# EasyEDA schematic New Project.json
TITLE: Sheet_1; REV: 1.0; Date: 2024-03-31; Sheet: 1/1; Company: Your Company
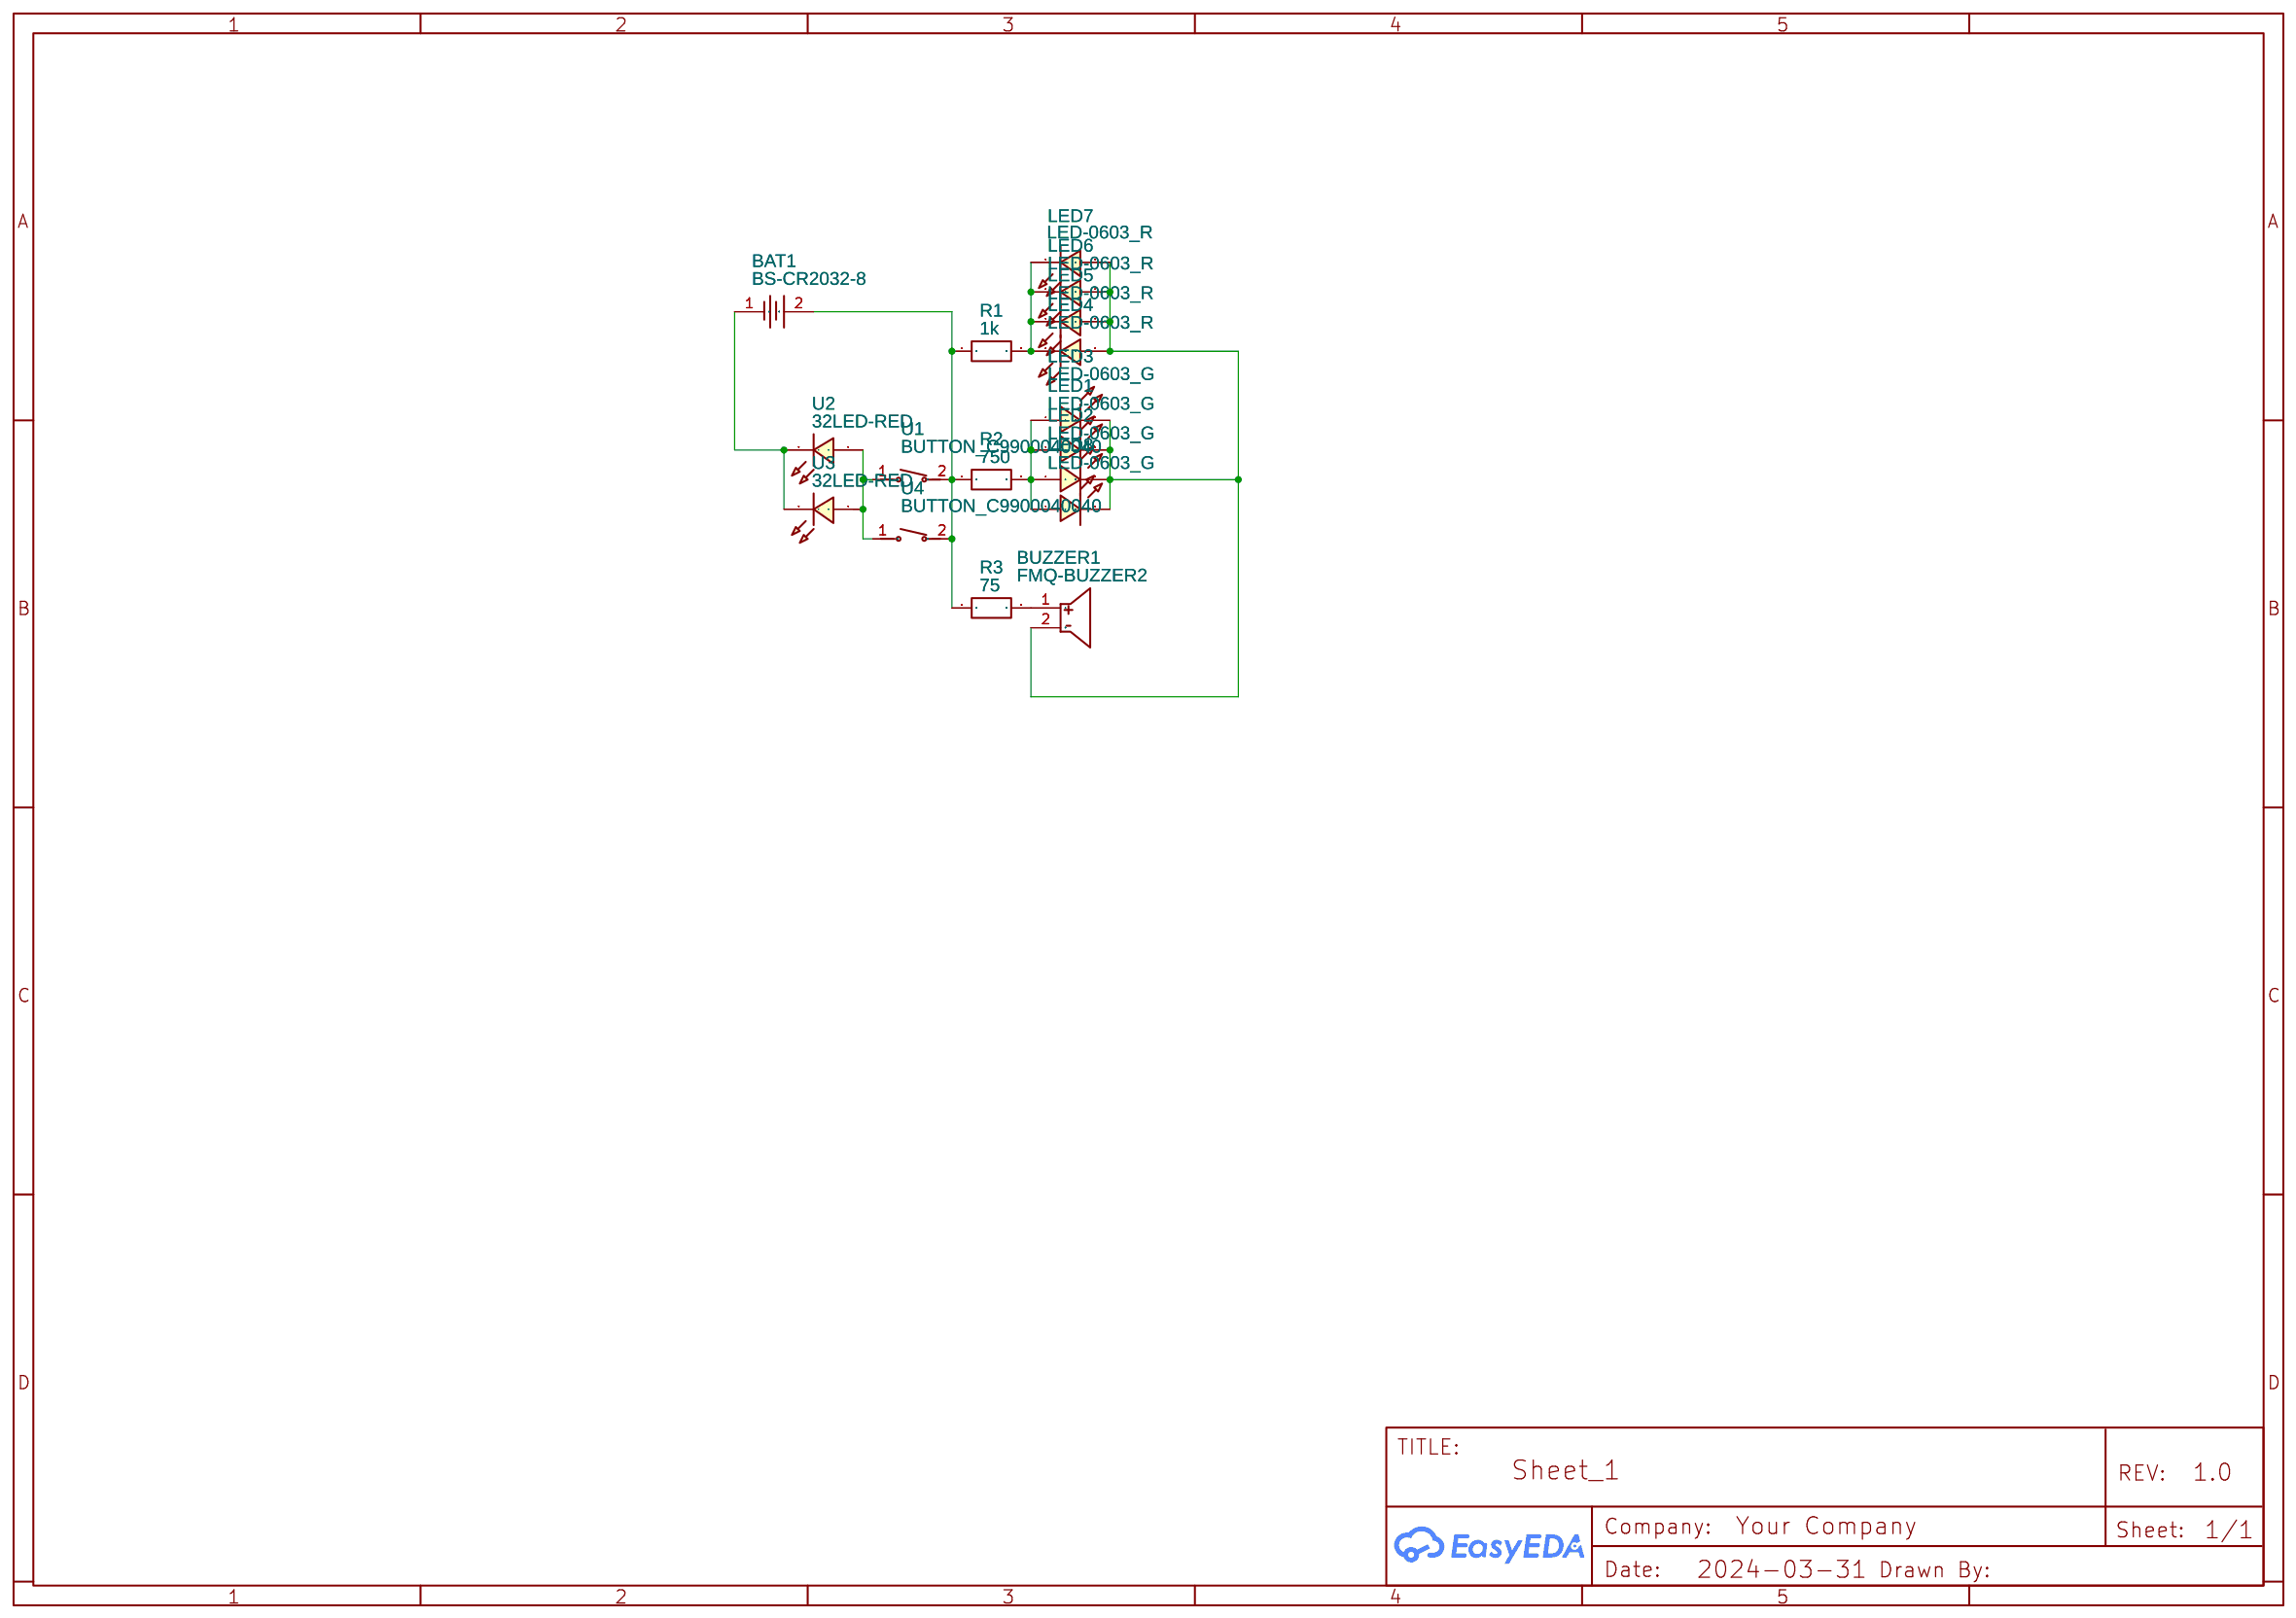
[diagram p0: schematic sheet]

## Parts
BAT1  BS-CR2032-8  [BAT-SMD_BS-CR2032-8]
BUZZER1  FMQ-BUZZER2  [BUZ-TH_BD12.0-P7.60-D0.6-FD]
LED1  LED-0603_G  [LED0603_GREEN]
LED2  LED-0603_G  [LED0603_GREEN]
LED3  LED-0603_G  [LED0603_GREEN]
LED4  LED-0603_R  [LED0603_RED]
LED5  LED-0603_R  [LED0603_RED]
LED6  LED-0603_R  [LED0603_RED]
LED7  LED-0603_R  [LED0603_RED]
LED8  LED-0603_G  [LED0603_GREEN]
R1  1k  [R1206]
R2  750  [R1206]
R3  75  [R1206]
U1  BUTTON_C9900040040  [KEY-SMD_L6.0-W6.0-LS6.6]
U2  32LED-RED  [LED-TH_L5..8-W5.6-P2.54_32LED-RED]
U3  32LED-RED  [LED-TH_L5..8-W5.6-P2.54_32LED-RED]
U4  BUTTON_C9900040040  [KEY-SMD_L6.0-W6.0-LS6.6]

## Library data of the parts
BAT1 = BS-CR2032-8: Supplier: LCSC; Supplier Part: C7498149; Manufacturer: LX(连欣科技); Contributor: lcsc; JLCPCB Part Class: Extended Part
BUZZER1 = FMQ-BUZZER2: Contributor: LCSC; Supplier: LCSC; Supplier Part: C9900006103; JLCPCB Part Class: Extended Part; Manufacturer: null
LED1-LED3 LED8 = LED-0603_G: Manufacturer: EVERLIGHT(台湾亿光); Manufacturer Part: 19-217/GHC-YR1S2/3T; Supplier Part: C72043; Supplier: LCSC; Contributor: LCEDA_Lib
LED4-LED7 = LED-0603_R: Manufacturer: EVERLIGHT(台湾亿光); Manufacturer Part: 19-217/R6C-AL1M2VY/3T; Supplier Part: C72044; Supplier: LCSC; Contributor: LCEDA_01
R1-R3 = R_1206_EU: Contributor: LCEDA_Lib
U1 U4 = BUTTON_C9900040040: Contributor: lcsc; Supplier: LCSC; Supplier Part: C9900040040; Manufacturer: null; Manufacturer Part: BUTTON; JLCPCB Part Class: Extended Part
U2 U3 = 32LED-RED: Supplier: LCSC; Supplier Part: C3306983; Manufacturer: Grayhill; JLCPCB Part Class: Extended Part; Contributor: lcsc

## Nets
Net-(BAT1-1): BAT1.1 U2.2(-) U3.2(-)
Net-(BAT1-2): BAT1.2 R1.1 R2.1 R3.1 U1.2(B) U4.2(B)
Net-(BUZZER1-1): BUZZER1.1 R3.2
Net-(BUZZER1-2): BUZZER1.2 LED1.2 LED2.2 LED3.2 LED4.1 LED5.1 LED6.1 LED7.1 LED8.2
Net-(LED1-1): LED1.1 LED2.1 LED3.1 LED8.1 R2.2
Net-(LED4-2): LED4.2 LED5.2 LED6.2 LED7.2 R1.2
Net-(U1-1): U1.1(A) U2.1(+) U3.1(+) U4.1(A)
